# Altium schematic sheet Motor_driver.SchDoc
size A3; SheetNumber: 3; SheetTotal: 3
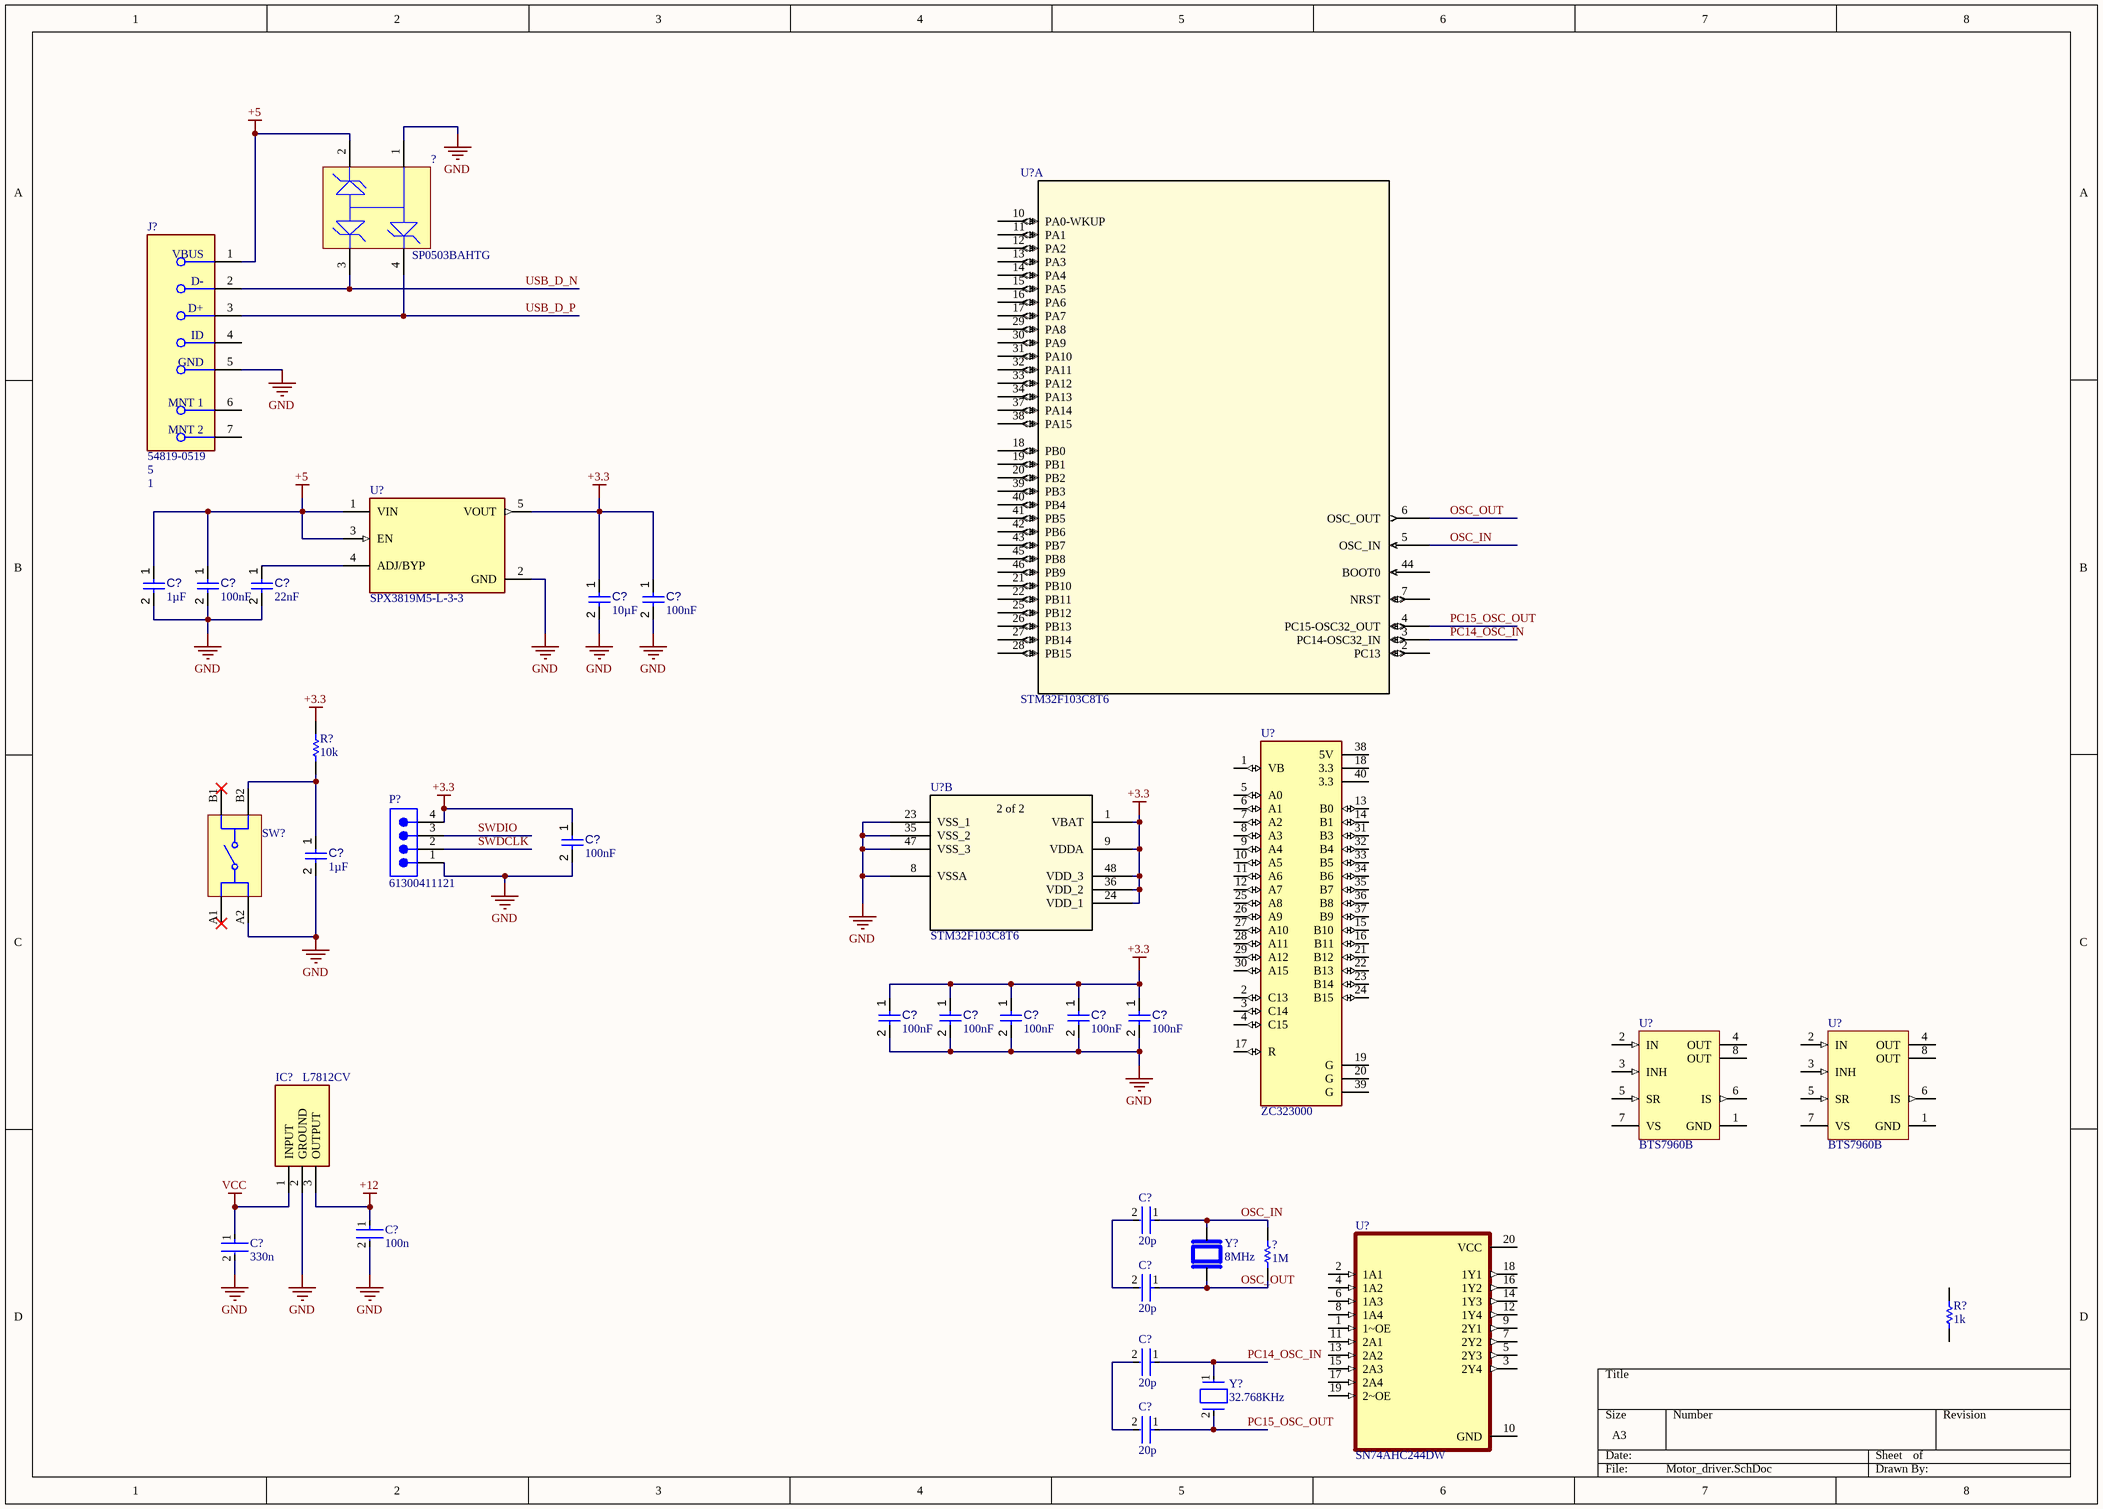
[diagram p0: Motor_driver.SchDoc]

## Parts
(Parts that share a designator on the sheet are numbered #1, #2 ... from top to bottom, then left to right.)
?#1  SP0503BAHTG  [LFUS-SOT143-4_V]
?#2  1M  [RESC1608X55X25LL10T15]
C?#1  value 1µF  [CAPC1608X94X35NL15T15]  (hidden comment: Capacitor 1 uF +/- 10% 16 V 0603)
C?#2  value 100nF  [CAPC1608X90X40NL10T20]  (hidden comment: Capacitor 100 nF +/-10% 50 V 0603)
C?#3  value 22nF  [CAPC1608X90X40NL10T20]  (hidden comment: Capacitor 22 nF +/-10% 50 V 0603)
C?#4  value 10µF  [CAPC0603(1608)100_L]  (hidden comment: Capacitor 10µF +/-20% 10V 0603)
C?#5  value 100nF  [CAPC1608X90X40NL10T20]  (hidden comment: Capacitor 100 nF +/-10% 50 V 0603)
C?#6  value 100nF  [CAPC1608X90X40NL10T20]  (hidden comment: Capacitor 100 nF +/-10% 50 V 0603)
C?#7  value 1µF  [CAPC1608X94X35NL15T15]  (hidden comment: Capacitor 1 uF +/- 10% 16 V 0603)
C?#8  value 100nF  [CAPC1608X90X40NL10T20]  (hidden comment: Capacitor 100 nF +/-10% 50 V 0603)
C?#9  value 100nF  [CAPC1608X90X40NL10T20]  (hidden comment: Capacitor 100 nF +/-10% 50 V 0603)
C?#10  value 100nF  [CAPC1608X90X40NL10T20]  (hidden comment: Capacitor 100 nF +/-10% 50 V 0603)
C?#11  value 100nF  [CAPC1608X90X40NL10T20]  (hidden comment: Capacitor 100 nF +/-10% 50 V 0603)
C?#12  value 100nF  [CAPC1608X90X40NL10T20]  (hidden comment: Capacitor 100 nF +/-10% 50 V 0603)
C?#13  100n  [FP-CL31-IPC_C]
C?#14  20p  [FP-C0603C-CF-MFG]
C?#15  330n  [FP-CL31-IPC_C]
C?#16  20p  [FP-C0603C-CF-MFG]
C?#17  20p  [FP-C0603C-CF-MFG]
C?#18  20p  [FP-C0603C-CF-MFG]
IC?  L7812CV  [TO255P460X1020X2008-3P]
J?  54819-0519  Number of Rows: 1  Number of Circuits: 5  [FP-54819-0519-MFG]
P?  61300411121  [61300411121]
R?#1  10k  [RESC1609X50X30NL8T20]
R?#2  1k  [RESC3216X70X50ML20T25]
SW?  430182043816  [430182043816]  (value not drawn)
U?#1  STM32F103C8T6  [LQFP48_STM]  (part A of 2)
U?#2  SPX3819M5-L-3-3  [SOT95P280X145-5N]
U?#3  STM32F103C8T6  [LQFP48_STM]  (part B of 2)
U?#4  ZC323000  [MODULE_ZC323000]
U?#5  BTS7960B  [INF-P-TO-263-7-6_M]
U?#6  BTS7960B  [INF-P-TO-263-7-6_M]
U?#7  SN74AHC244DW  [SOIC127P1030X265-20N]
Y?#1  8MHz  [XTAL_HC49P488W46L1150T500H350]
Y?#2  32.768KHz  [FP-ABS07-MFG]

## Nets
+3.3: C?#4.1 C?#5.1 C?#6.1 C?#8.1 C?#9.1 C?#10.1 C?#11.1 C?#12.1 P?.4 R?#1.1 U?#2.5(VOUT) U?#3.1(VBAT) U?#3.9(VDDA) U?#3.24(VDD_1) U?#3.36(VDD_2) U?#3.48(VDD_3)
+5: ?#1.2 C?#1.1 C?#2.1 J?.1(VBUS) U?#2.1(VIN) U?#2.3(EN)
+12: C?#13.1 IC?.3(OUTPUT)
GND: ?#1.1 C?#1.2 C?#2.2 C?#3.2 C?#4.2 C?#5.2 C?#6.2 C?#7.2 C?#8.2 C?#9.2 C?#10.2 C?#11.2 C?#12.2 C?#13.2 C?#15.2 IC?.2(GROUND) J?.5(GND) P?.1 SW?.A2 U?#2.2(GND) U?#3.8(VSSA) U?#3.23(VSS_1) U?#3.35(VSS_2) U?#3.47(VSS_3)
VCC: C?#15.1 IC?.1(INPUT)
OSC_IN: ?#2.2 C?#14.1 U?#1.5(OSC_IN) Y?#1.1
OSC_OUT: ?#2.1 C?#16.1 U?#1.6(OSC_OUT) Y?#1.2
PC14_OSC_IN: C?#17.1 U?#1.3(PC14-OSC32_IN) Y?#2.1
PC15_OSC_OUT: C?#18.1 U?#1.4(PC15-OSC32_OUT) Y?#2.2
SWDCLK: P?.2
SWDIO: P?.3
USB_D_N: ?#1.3 J?.2(D-)
USB_D_P: ?#1.4 J?.3(D+)
NetC?#3_1: C?#3.1 U?#2.4(ADJ/BYP)
NetC?#7_1: C?#7.1 R?#1.2 SW?.B2
NetC?#14_2: C?#14.2 C?#16.2
NetC?#17_2: C?#17.2 C?#18.2

Not connected (* = marked no-connect by the designer): J? 4(ID) 6(MNT_1) 7(MNT_2); R?#2 1 2; SW? A1* B1*; U?#1 2(PC13) 7(NRST) 10(PA0-WKUP) 11(PA1) 12(PA2) 13(PA3) 14(PA4) 15(PA5) 16(PA6) 17(PA7) 18(PB0) 19(PB1) 20(PB2) 21(PB10) 22(PB11) 25(PB12) 26(PB13) 27(PB14) 28(PB15) 29(PA8) 30(PA9) 31(PA10) 32(PA11) 33(PA12) 34(PA13) 37(PA14) 38(PA15) 39(PB3) 40(PB4) 41(PB5) 42(PB6) 43(PB7) 44(BOOT0) 45(PB8) 46(PB9); U?#4 1(VB) 2(C13) 3(C14) 4(C15) 5(A0) 6(A1) 7(A2) 8(A3) 9(A4) 10(A5) 11(A6) 12(A7) 13(B0) 14(B1) 15(B10) 16(B11) 17(R) 18(3.3) 19(G) 20(G) 21(B12) 22(B13) 23(B14) 24(B15) 25(A8) 26(A9) 27(A10) 28(A11) 29(A12) 30(A15) 31(B3) 32(B4) 33(B5) 34(B6) 35(B7) 36(B8) 37(B9) 38(5V) 39(G) 40(3.3); U?#5 1(GND) 2(IN) 3(INH) 4(OUT) 5(SR) 6(IS) 7(VS) 8(OUT); U?#6 1(GND) 2(IN) 3(INH) 4(OUT) 5(SR) 6(IS) 7(VS) 8(OUT); U?#7 1(1~OE) 2(1A1) 3(2Y4) 4(1A2) 5(2Y3) 6(1A3) 7(2Y2) 8(1A4) 9(2Y1) 10(GND) 11(2A1) 12(1Y4) 13(2A2) 14(1Y3) 15(2A3) 16(1Y2) 17(2A4) 18(1Y1) 19(2~OE) 20(VCC)

## Notes on the sheet
- (in symbol STM32F103C8T6, part B) 2 of 2

## Library data of the parts
?#1 = CMP-2000-05191-1: TVS Diode Array, 30 pF, 30 KV, -40 to 85 degC, 4-Pin SOT143, RoHS, Tape and Reel; Manufacturer: Littelfuse; Direction Type: Uni-Directional; Product Height (mm): 1.05mm; Leakage Current (Max): 0.1uA; Clamping Voltage (Max): 8V; Reverse Stand-off Voltage: 5.5(Min)V; Configuration: Triple; Working Voltage: 5.5V; Product Length (mm): 3.04mm; Working Voltage (Max): 5.5V(Min); Capacitance Value: 30pF; Rad Hardened: No; Number of Elements: 3; Product Depth (mm): 1.4mm; Operating Temperature Max Deg. C: 85C; Suppressor Type: TVS; Operating Temperature Min Deg. C: -40C; Operating Temp Range: -40Cto85C; Mounting: SurfaceMount; Package / Case: SOT-143; Datasheet Version: Dec-13; Package Type: SOT-143; Packaging: TapeandReel; Pin Count: 3+Tab; Operating Temperature Classification: Industrial; Datasheet URL: https://datasheet.ciiva.com/15143/getdatasheetpartid-116020-15143550.pdf; Manufacturer URL: http://www.littelfuse.com/; Leakage Current: 0.1uA; Mounting Style: SurfaceMount; Clamping Voltage: 8V; Polarity: Uni-Directional
?#2 = CMP-1659-00056-1: Chip Resistor, 1 MOhm, +/- 1%, 100 mW, -55 to 155 degC, 0603 (1608 Metric), RoHS, Tape and Reel; Voltage Rating (DC): 25 V; Tolerance: 20%; Case\Package: Radial; Capacitance: 1 mF; Min Operating Temperature: -40 degC; PackageDescription: 2-Pin Surface Mount Device, Body 1.6 x 0.8 mm; ComponentLink1Description: Manufacturer URL; Radiation Hardening: No; DatasheetVersion: Rev. 4, 02/2016; REACH SVHC: No SVHC; Length: 20 mm; Max Operating Temperature: 85 degC; Diameter: 10 mm; Packaging: Bulk; Package Quantity: 200; PackageReference: 0603; Mount: Through Hole; ComponentLink1URL: http://www.yageo.com/; ComponentLink2URL: http://www.yageo.com/documents/recent/PYu-RC_Group_51_RoHS_L_04.pdf; ComponentLink2Description: Datasheet; Width: 0 inch; Lead Pitch: 5 mm; RoHSCompliant: true; Voltage Rating: 25 V; Height: 20 mm
C?#1 C?#7 = CMP-001-00003-6: Chip Capacitor, 1 uF, +/- 10%, 16 V, 0603 (1608 Metric); Voltage Rating: 16V; Capacitor Type: Ceramic; Max Operating Temperature: 125°C; Pins: 2; Tolerance: 10%; Min Operating Temperature: -55°C; RoHS Compliant: True; Mounting Technology: SM; Case/Package: 0603
C?#2 C?#5 C?#6 C?#8-C?#12 = CMP-001-00017-6: Chip Capacitor, 100 nF, +/- 10%, 50 V, 0603 (1608 Metric); Voltage Rating: 50V; Capacitor Type: Ceramic; Tolerance: 10%; Mounting Technology: SM; Max Operating Temperature: 125°C; RoHS Compliant: True; Pins: 2; Case/Package: 0603; Min Operating Temperature: -55°C
C?#3 = CMP-001-00017-6: Chip Capacitor, 22 nF, +/- 10%, 50 V, 0603 (1608 Metric); Voltage Rating: 50V; Capacitor Type: Ceramic; Tolerance: 10%; Mounting Technology: SM; Max Operating Temperature: 125°C; RoHS Compliant: True; Pins: 2; Case/Package: 0603; Min Operating Temperature: -55°C
C?#4 = CMP-001-00075-4: Chip Capacitor, 10µF +/-20%, 10V, 0603, Thickness 1 mm; Tolerance: 10%; Voltage Rating: 10V; Max Operating Temperature: 85°C; Pins: 2; Case/Package: 0603; Mounting Technology: SMT; Min Operating Temperature: -55°C
C?#13 C?#15 = CMP-13271-001514-1: CL31B104KCFNNNE, Cap Ceramic 100nF 100V X7R ±10% SMD 1206 +125°C Embossed T/R; Mount: Surface Mount; Material: Ceramic; Radiation Hardening: No; Depth: 1.6mm; Min Operating Temperature: -55°C; Contact Plating: Tin; Case Code (Imperial): 1206; Voltage: 100V; Width: 0.063inch; Capacitance: 100nF; Voltage Rating: 100V; Packaging: Tape and Reel; Voltage Rating (DC): 100V; Length: 3.2mm; Thickness: 0.055inch; Height: 1.25mm; Package Quantity: 1; Dielectric: X7R; Max Operating Temperature: 125°C; Case Code (Metric): 3216; Lead Free: Lead Free; Case/Package: 1206; Tolerance: 10%
C?#14 C?#16-C?#18 = CMP-1035-00783-3: CAP CER 20PF 50V 5% NP0 0603; Manufacturer Part Number: C0603C200J5GACTU; Manufacturer: KEMET; Temperature Coefficient: 30ppm/°C; Temperature Characteristic: C0G; Automotive Grade: Grade 1; Tolerance: 0.05; Material: Ceramic; Category: Cap; Temperature Range Low: -55°C; RoHS: TRUE; ComponentLink2URL: https://api.kemet.com/component-edge/download/datasheet/C0603C100J5GACAUTO.pdf; Package: C0603C-CF; Height: 0.87mm; Capacitance: 20 pF; Voltage Rating: 50 V; Octopart: https://octopart.com/c0603c200j5gactu-kemet-9138585; Device Class L1: Passive Components; Automotive: Yes; Digikey Description: CAP CER 20PF 50V 5% NP0 0603; Temperature Range High: +125°C; Device Class L3: Ceramic Capacitors; Mouser Description: Multilayer Ceramic Capacitors MLCC - SMD/SMT 50volts 20pF C0G 5%; ComponentLink2Description: Datasheet; Device Class L2: Capacitors; Lead Free: Yes; Temperature: -55°C to +125°C; Value: 20 pF
IC? = L7812CV: Integrated Circuit; Manufacturer_Name: STMicroelectronics; Datasheet Link: http://www.st.com/web/en/resource/technical/document/datasheet/CD00000444.pdf; Height: 4.6mm; Manufacturer_Part_Number: L7812CV; Mouser Part Number: 511-L7812CV; Mouser Price/Stock: https://www.mouser.co.uk/ProductDetail/STMicroelectronics/L7812CV?qs=5Uvc6lfWVJzVGZQZmBynyg%3D%3D; Arrow Part Number: L7812CV; Arrow Price/Stock: https://www.arrow.com/en/products/l7812cv/stmicroelectronics?utm_currency=USD&region=europe
J? = CMP-04767-000009-1: CONN RCPT USB2.0 MINI B 5P R/A; Max Current Rating: 1A; Pitch: 0.8mm; Contact Resistance: 50mR; Data Rate: 480Mbps; Gender: Receptacle; Connector Type: USB; Working Voltage: 30V; Insulation Resistance: 100MR; Series: 54819; USB Standard: USB 2.0; Contact Plating: Gold; Min Operating Temperature: 0°C; Radiation Hardening: No; Current Rating: 1A; Number of Terminals/Pins: 5; Number of Positions: 5; Packaging: Tray; Termination: Solder; Orientation: Right Angle; Flammability Rating: UL94 V-0; Package Quantity: 3600; Number of Contacts: 5; Lead Free: Lead Free; Number of Ports: 1; Max Operating Temperature: 50°C; Color: Black; Housing Color: Black; Contact Material: Copper Alloy; Width: 6.9mm; Length: 7.7mm; Housing Material: Polyamide; Features: Shielded; Mount: Through Hole; Voltage Rating: 30V; Depth: 9mm; Voltage Rating (DC): 30V
P? = CMP-1502-01064-3: NexarPartId: 32855522; Operating Supply Voltage: 250V; Pitch: 2.54mm; Contact Resistance: 20mΩ; Number of Positions: 4; Current Rating: 3A; Connector Type: Male Pin; Gender: Male; Contact Plating: Gold; Height: 8.89mm; Lead Pitch: 2.54mm; Lead Free: Lead Free; Contact Mating Length: 5.9944mm; Number of Rows: 1; Termination: Solder; Packaging: Bulk; REACH SVHC: Unknown; Min Operating Temperature: -40°C; RoHS: Compliant; Number of Contacts: 4; Voltage Rating: 250V; Color: Black; Max Operating Temperature: 105°C; Contact Material: Copper; Mount: Through Hole; Orientation: Vertical; Number of Pins: 4
R?#1 = CMP-1666-00005-4: Chip Resistor, 10 KOhm, +/- 1%, 100 mW, -55 to 155 degC, 0603 (1608 Metric), RoHS, Tape and Reel; Manufacturer: Vishay Semiconductor; Voltage Rating: 75 V; Max Operating Temperature: 155 degC; PackageDescription: 2-Pin Surface Mount Device, Body 1.575 x 0.85 mm; ComponentLink1Description: Manufacturer URL; RoHSCompliant: true; PackageReference: 0603; REACH SVHC: Unknown; Length: 1.55 mm; DatasheetVersion: 06/2012; Packaging: Tape and Reel; Min Operating Temperature: -55 degC; Mounting Technology: Surface Mount; ComponentLink2URL: https://datasheet.ciiva.com/11809/0900766b80d98afc-11809037.pdf; Height: 0.45 mm; ComponentLink2Description: Datasheet; Package Quantity: 5000; ComponentLink1URL: http://www.vishay.com/
R?#2 = CMP-2003-04406-1: ERA8AEB102V, 0.25W Thin Film Resistor 150V ±0.1% ±25ppm/℃ 1kΩ 1206 Chip Resistor - Surface Mount ROHS; Manufacturer: Panasonic; Part Number: ERA8AEB102V
SW? = CMP-1452-00013-3: Switch Tactile N.O. SPST Round Button Gull Wing 0.05A 12VDC 1000000Cycles 1.57N SMD Reel; Switch Travel: 250µm; Current Rating: 50mA; Mechanical Life: 1Mcycles; Actuator Length: 900µm; Insulation Resistance: 100MΩ; Actuator Material: Liquid Crystal Polymer, Polymer; Switch Function: Off-Mom; Illumination Type: Illuminated, Non-Illuminated; Voltage Rating: 12V; REACH SVHC: No SVHC; Contact Current Rating: 50mA; RoHS: Compliant; Length: 6.2mm; Throw Configuration: SPST; Termination: Gull Wing; Contact Plating: Silver; Mount: Surface Mount; Diameter: 3.5mm; Color: Black; Width: 6.2mm; Height: 4.3mm; Contact Material: Stainless Steel, Steel; Max Operating Temperature: 85°C; Packaging: Tape and Reel; Min Operating Temperature: -40°C; Lead Free: Lead Free; Contact Resistance: 100mΩ
U?#1 U?#3 = STM32F103C8T6: No Description Available; Mfr_Name: STMicroelectronics; RefDes: RefDes; Type: Type
U?#2 = CMP-031-00006-1: Linear Voltage Regulator IC Positive Fixed 1 Output 500mA SOT-23-5; MF: MaxLinear, Inc.; MP: SPX3819M5-L-3-3/TR; Value: *; Case/Package: SOT-23-5 Exar; Pins: 5; Check_prices: https://www.snapeda.com/parts/SPX3819M5-L-3-3/TR/MaxLinear%252C+Inc./view-part/?ref=eda; Component Type: Standard; SnapEDA_Link: https://www.snapeda.com/parts/SPX3819M5-L-3-3/TR/MaxLinear%252C+Inc./view-part/?ref=snap; Source: SPX3819M5-L-3-3.SchLib; Design Item ID: SPX3819M5-L-3-3
U?#4 = CMP-007-000000-1: STM32F103C8T6 ARM STM32 Minimum System Development Board Module For Arduino; Pin Count: 40; Package: None; Availability: Unavailable; Source: ZC323000.SchLib; Design Item ID: ZC323000; Price: None; MP: ZC323000; Component Type: Standard; Value: *
U?#5 U?#6 = CMP-1114-00025-1: High Current PN Half Bridge NovalithIC, -40 to 150 degC, P-TO-263-7-6; Manufacturer: Infineon; Iq (typ): 7 uA; Green: FALSE; ComponentLink1Description: Manufacturer URL; Halogen-free: FALSE; PackageDescription: 7-Pin Plastic Transistor Single Outline Package, 9.9 x 9.2 mm Body, 1.27 mm Pitch; ComponentLink2Description: Datasheet; ComponentLink3Description: Package Specification; ComponentLink1URL: http://www.infineon.com/; ComponentLink2URL: http://www.infineon.com/dgdl/BTS7960_Datasheet.pdf?folderId=db3a304412b407950112b408e8c90004&fileId=db3a304412b407950112b43945006d5d&location=en.Products.Automotive_ICs.Motor_Drivers__Automotive_.Integrated_High_Current_Motor_Drivers__NovalithIC____Trilith; ComponentLink3URL: http://www.infineon.com/dgdl/BTS7970B_Datasheet.pdf?folderId=db3a304412b407950112b408e8c90004&fileId=db3a304412b407950112b43949b36d61&sId=db3a30433d68e984013d7db637dc5e6a; PackageReference: P-TO-263-7-6; PackageVersion: May-06; Mounting Technology: Surface Mount; RevisionNote: Re-Activated Devices; PartNumber: BTS7960B; DatasheetVersion: Rev. 1.1
U?#7 = CMP-009-000000-1: 8-ch, 2-V to 5.5-V buffers with 3-state outputs; MF: Texas Instruments; Design Item ID: SN74AHC244DW; SnapEDA_Link: https://www.snapeda.com/parts/SN74AHC244DW/Texas+Instruments/view-part/?ref=snap; Check_prices: https://www.snapeda.com/parts/SN74AHC244DW/Texas+Instruments/view-part/?ref=eda; Package: SOIC-20 Texas Instruments; Source: SN74AHC244DW.SchLib; Value: *; MP: SN74AHC244DW; Component Type: Standard; Pin Count: 20
Y?#1 = CMP-003-00030-1: HC/49US (AT49) MICROPROCESSOR CRYSTAL; MF: Abracon; MP: ABL-8.000MHZ-B2; Purchase-URL: https://pricing.snapeda.com/search/part/ABL-8.000MHZ-B2/?ref=eda; Case/Package: HC-49/US ABRACON; SnapEDA_Link: https://www.snapeda.com/parts/ABL-8.000MHZ-B2/Abracon+LLC/view-part/?ref=snap; Value: *; Source: ABL-8.000MHZ-B2.SchLib; Availability: In Stock; Design Item ID: ABL-8.000MHZ-B2; Pins: 2; Price: None; Component Type: Standard; Check_prices: https://www.snapeda.com/parts/ABL-8.000MHZ-B2/Abracon+LLC/view-part/?ref=eda
Y?#2 = CMP-27762-013661-2: Crystal 32.768kHz ±20ppm (Tol) 9pF FUND 70kΩ 2-Pin CSMD T/R; Insulation Resistance: 500MR; Series Resistance: 70kR; Packaging: Tape and Reel; Length: 3.2mm; Max Operating Temperature: 85°C; Mount: Surface Mount; Height: 0.9mm; Number of Pins: 2; Depth: 1.5mm; Series: ABS07; REACH SVHC: No SVHC; Tolerance: 20ppm; Radiation Hardening: No; Case/Package: CSMD; Package Quantity: 3000; Termination: SMD/SMT; Operating Frequency: 32.768 kHz; Width: 1.5mm; Load Capacitance: 9pF; Lead Free: Lead Free; Frequency Tolerance: 20ppm; Frequency Stability: 20ppm; Frequency: 32.768kHz; ESR (Equivalent Series Resistance): 70kR; RoHS Compliant: Yes; Min Operating Temperature: -40°C